# Altium schematic sheet MotorControl.SchDoc: Motor Control
size A4; Date: 2022 Fall; Address1: LK Bulls; Address2: Bagoly Zoltan; Address3: Feher Daniel; Address4: G. Varga Gabor; DocumentNumber: 10; Revision: 1.0; SheetNumber: 10; SheetTotal: 14
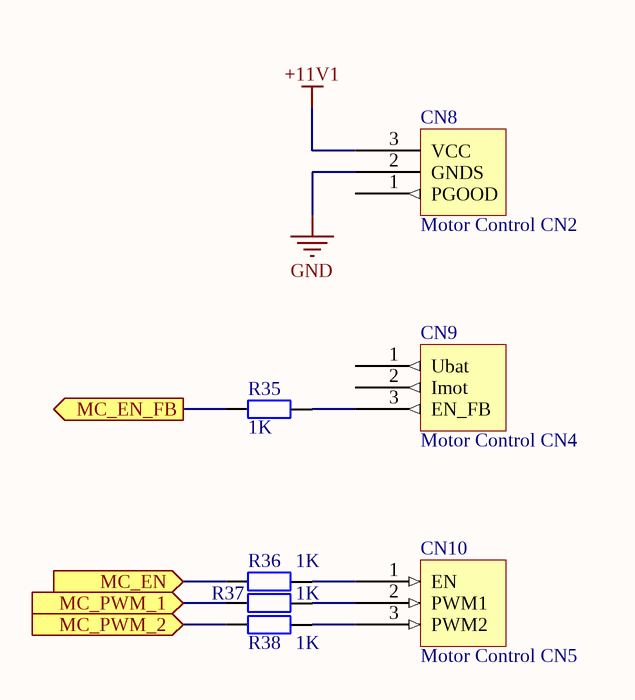
[diagram p0: MotorControl.SchDoc]

## Parts
CN8  Motor Control CN2  [DC_Drive_CN_Stelvio]
CN9  Motor Control CN4  [DC_Drive_CN_Stelvio]
CN10  Motor Control CN5  [DC_Drive_CN_Stelvio]
R35  1K  [FP_0805_RES]
R36  1K  [FP_0805_RES]
R37  1K  [FP_0805_RES]
R38  1K  [FP_0805_RES]

## Ports
MC_EN (in), MC_EN_FB (out), MC_PWM_1 (in), MC_PWM_2 (in)

## Nets
+11V1: CN8.3(VCC)
GND: CN8.2(GNDS)
MC_EN: R36.1 ; port MC_EN
MC_EN_FB: R35.1 ; port MC_EN_FB
MC_PWM_1: R37.1 ; port MC_PWM_1
MC_PWM_2: R38.1 ; port MC_PWM_2
NetCN9_3: CN9.3(EN_FB) R35.2
NetCN10_1: CN10.1(EN) R36.2
NetCN10_2: CN10.2(PWM1) R37.2
NetCN10_3: CN10.3(PWM2) R38.2

Not connected (* = marked no-connect by the designer): CN8 1(PGOOD); CN9 1(Ubat) 2(Imot)

## Notes on the sheet
- Title
- Size:
- Date:
- A4
- Number:
- Revision:
- Sheet
- of
- Designed by:
- File:

## Library data of the parts
CN8 = Motor_Control_CN2: CN2 connector on the Motor Control PCB; Name: SORKAPOCS 3 P RM3.81 CPP3.81/3 (STE) LIFTES 1mmř 10A; Supplier: Lomex; Reference: 43-09-55
CN9 = Motor_Control_CN4: CN4 connector on the Motor Control PCB; Name: SORKAPOCS 3 P RM3.81 CPP3.81/3 (STE) LIFTES 1mmř 10A; Supplier: Lomex; Reference: 43-09-55
CN10 = Motor_Control_CN5: CN5 connector on the Motor Control PCB; Name: SORKAPOCS 3 P RM3.81 CPP3.81/3 (STE) LIFTES 1mmř 10A; Supplier: Lomex; Reference: 43-09-55
R35-R38 = RES: Resistor; Tolerance: 5%; Power: 0.125W; Name: 1K00 0805 5% CR-05JL7----1K 0.125W (VIK); Supplier: Lomex; Reference: 81-10-87; Value: 1K